# Altium schematic sheet B001 PCIe Socket.SchDoc: B001 PCIe Socket
size 292 x 193 mm; SheetNumber: 16; SheetTotal: 18
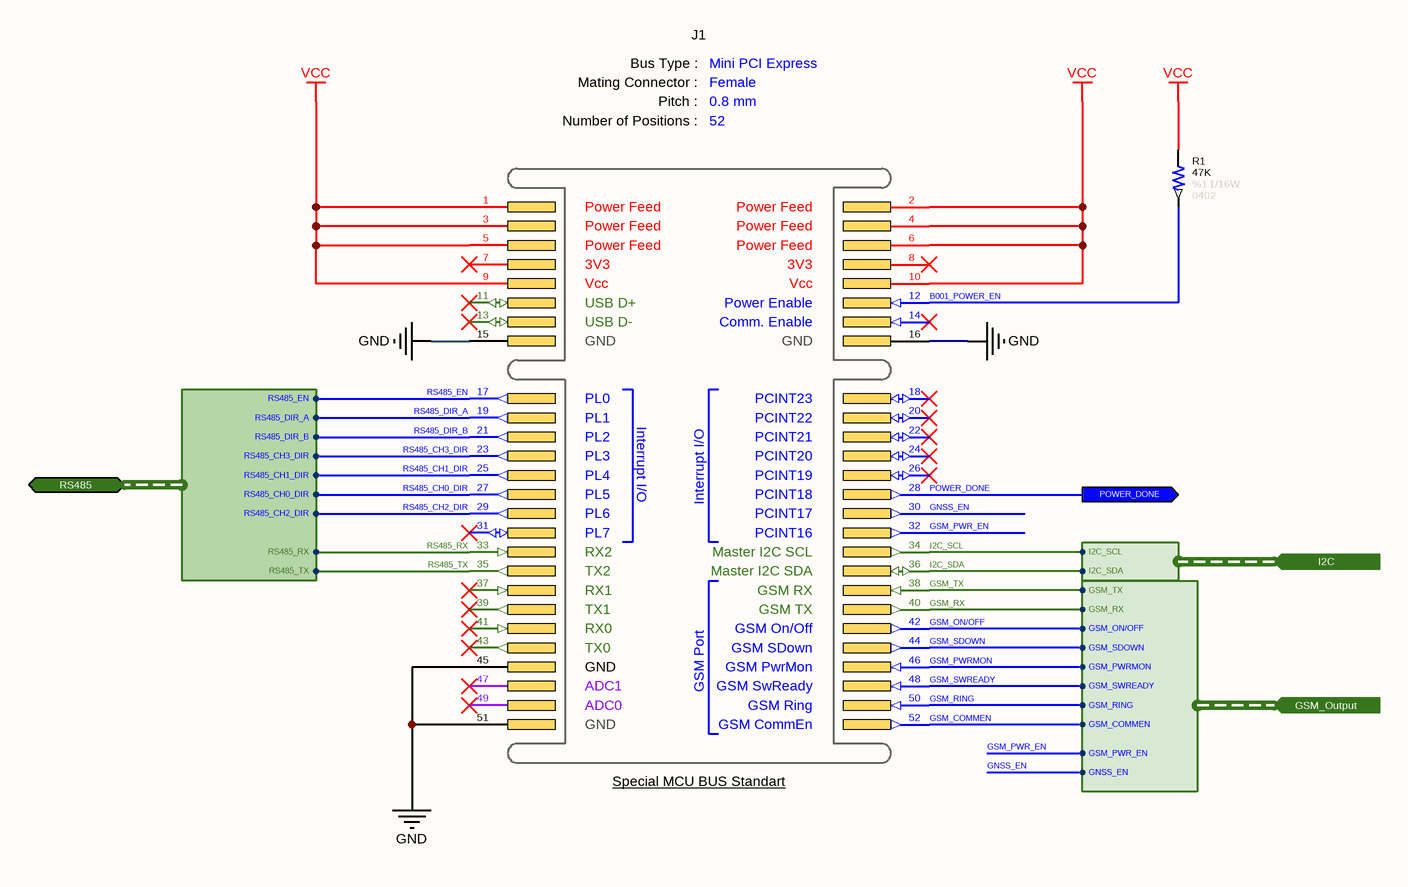
[diagram p0: B001 PCIe Socket.SchDoc]

## Parts
J1  BUS Type: Mini PCI Express  Connector Type: Female  Pitch: 0.8 mm  Number of Positions: 52  [CONNECTOR - Mini PCIe]  (hidden comment: TE-1775862-2)
R1  value 47K  Tolerance: %1  Case: 0402  Power: 1/16W  [RESISTOR_0402]  (hidden comment: 47K - 0402 - %1 - 1/16W)

## Ports
GSM_Output (in, harness GSM_Output), I2C (in, harness I2C), POWER_DONE (out), RS485 (bidir, harness RS485)

## Harnesses
I2C: I2C_SDA, I2C_SCL
RS485: RS485_RX, RS485_TX, RS485_EN, RS485_DIR_A, RS485_DIR_B, RS485_CH0_DIR, RS485_CH1_DIR, RS485_CH2_DIR, RS485_CH3_DIR
GSM_Output: GSM_SDOWN, GSM_ON/OFF, GSM_TX, GSM_RX, GSM_PWRMON, GSM_SWREADY, GSM_RING, GSM_COMMEN, GSM_PWR_EN, GNSS_EN

## Nets
GND: J1.15(Pin-15) J1.16(Pin-16) J1.45(Pin-45) J1.51(Pin-51)
VCC: J1.1(Pin-1) J1.2(Pin-2) J1.3(Pin-3) J1.4(Pin-4) J1.5(Pin-5) J1.6(Pin-6) J1.9(Pin-9) J1.10(Pin-10) R1.2
B001_POWER_EN: J1.12(Pin-12) R1.1
GNSS_EN: J1.30(Pin-30) ; port GSM_Output.GNSS_EN
GSM_COMMEN: J1.52(Pin-52) ; port GSM_Output.GSM_COMMEN
GSM_ON/OFF: J1.42(Pin-42) ; port GSM_Output.GSM_ON/OFF
GSM_PWR_EN: J1.32(Pin-32) ; port GSM_Output.GSM_PWR_EN
GSM_PWRMON: J1.46(Pin-46) ; port GSM_Output.GSM_PWRMON
GSM_RING: J1.50(Pin-50) ; port GSM_Output.GSM_RING
GSM_RX: J1.40(Pin-40) ; port GSM_Output.GSM_RX
GSM_SDOWN: J1.44(Pin-44) ; port GSM_Output.GSM_SDOWN
GSM_SWREADY: J1.48(Pin-48) ; port GSM_Output.GSM_SWREADY
GSM_TX: J1.38(Pin-38) ; port GSM_Output.GSM_TX
I2C_SCL: J1.34(Pin-34) ; port I2C.I2C_SCL
I2C_SDA: J1.36(Pin-36) ; port I2C.I2C_SDA
POWER_DONE: J1.28(Pin-28) ; port POWER_DONE
RS485_CH0_DIR: J1.27(Pin-27) ; port RS485.RS485_CH0_DIR
RS485_CH1_DIR: J1.25(Pin-25) ; port RS485.RS485_CH1_DIR
RS485_CH2_DIR: J1.29(Pin-29) ; port RS485.RS485_CH2_DIR
RS485_CH3_DIR: J1.23(Pin-23) ; port RS485.RS485_CH3_DIR
RS485_DIR_A: J1.19(Pin-19) ; port RS485.RS485_DIR_A
RS485_DIR_B: J1.21(Pin-21) ; port RS485.RS485_DIR_B
RS485_EN: J1.17(Pin-17) ; port RS485.RS485_EN
RS485_RX: J1.33(Pin-33) ; port RS485.RS485_RX
RS485_TX: J1.35(Pin-35) ; port RS485.RS485_TX

Not connected (* = marked no-connect by the designer): J1 7(Pin-7)* 8(Pin-8)* 11(Pin-11)* 13(Pin-13)* 14(Pin-14)* 18(Pin-18)* 20(Pin-20)* 22(Pin-22)* 24(Pin-24)* 26(Pin-26)* 31(Pin-31)* 37(Pin-37)* 39(Pin-39)* 41(Pin-41)* 43(Pin-43)* 47(Pin-47)* 49(Pin-49)*

## Notes on the sheet
- © 2021 All rights reserved.
  This document may not, in whole or in part, be copied, photocopied, reproduced, translated or converted to any electronic or machine readable from without prior written permission of Mehmet Günce Akkoyun.
  Engineer contact : akkoyun@me.com
- Property of
- Engineer :
- Date :
- Size :
- A4
- Time :
- Project :
- Page :
- /
- Customer :
- Product ID :
- Module ID :
- Version :
- File :
- Revision :
- (in symbol Connector - Mini PCI-E (Female B001)) Bus Type :; Mating Connector :; Pitch :; Number of Positions :; Power Feed; 3V3; Vcc; USB D+; Power Enable; USB D-; Comm. Enable; GND; PL0; PCINT23; PL1; PCINT22; Interrupt I/O; PL2; PCINT21; PL3; PCINT20; PL4; PCINT19; PL5; PCINT18; PL6; PCINT17; PL7; PCINT16; RX2; Master I2C SCL; TX2; Master I2C SDA; RX1; GSM RX; TX1; GSM TX; RX0; GSM Port; GSM On/Off; TX0; GSM SDown; GSM PwrMon; ADC1; GSM SwReady; ADC0; GSM Ring; GSM CommEn; Special MCU BUS Standart

## Library data of the parts
J1 = Connector - Mini PCI-E (Female B001): Mini PCI-Express female connector.; Manufacturer Name: TE Connectivity; Manufacturer Part Number: TE-1775862-2; System: Connector
R1 = Resistor - 47K [0402]: Thick Film Resistors - SMD 1/16 W 47 KOhm 1%; Manufacturer Name: Vishay; Manufacturer Part Number: CRCW040247K0FKED; ComponentLink1Description: DataSheet; ComponentLink1URL: https://www.mouser.com.tr/datasheet/2/427/dcrcwe3-1762152.pdf; ComponentLink2Description: Mouser; ComponentLink2URL: https://www.mouser.com.tr/ProductDetail/Vishay-Dale/CRCW040247K0FKED?qs=sGAEpiMZZMu61qfTUdNhG2DpbjADlD3GL%252B3h1elTxqU%3D